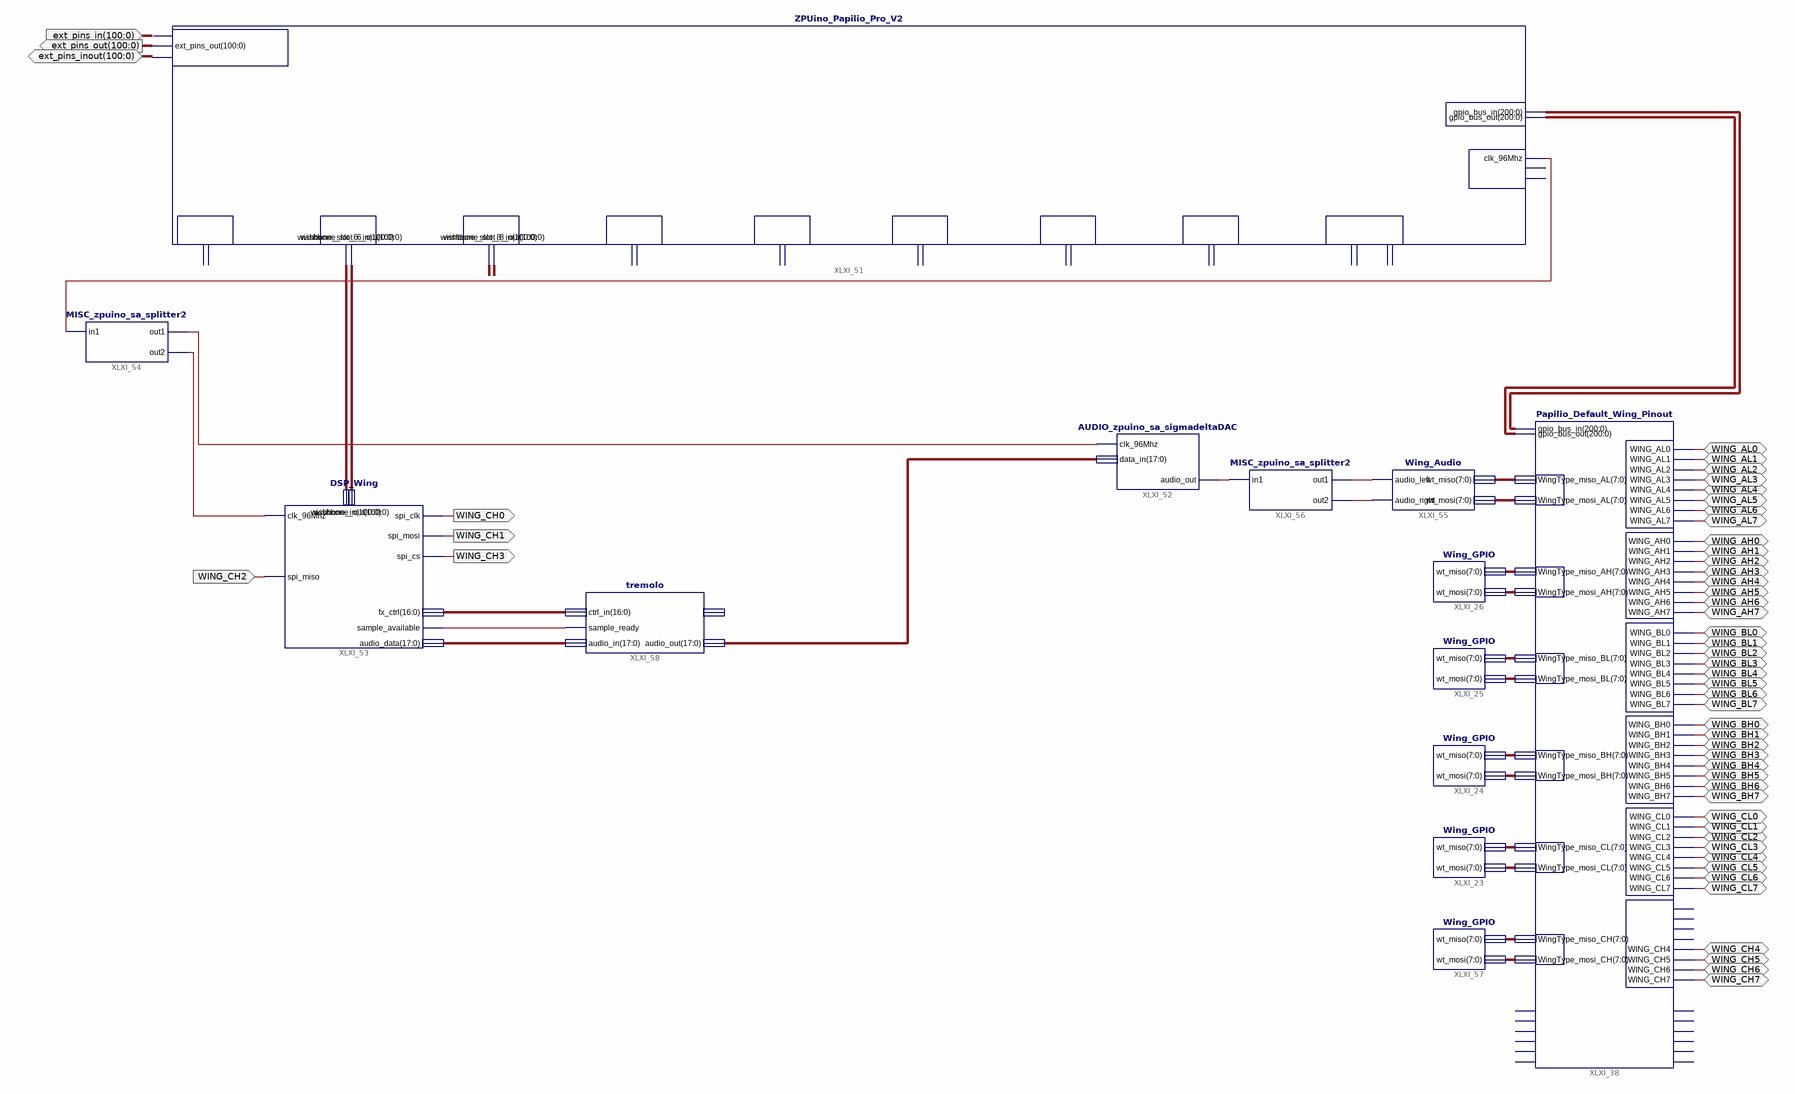
[diagram p0: schematic sheet 1]
// Xilinx ISE schematic Papilio_Pro.sch (spartan6) as structural Verilog: 13 symbols, 51 ports
module Papilio_Pro (
  input  [100:0] ext_pins_in,
  input  WING_CH2,
  inout  WING_AH0,
  inout  WING_AH1,
  inout  WING_AH2,
  inout  WING_AH3,
  inout  WING_AH4,
  inout  WING_AH5,
  inout  WING_AH6,
  inout  WING_AH7,
  inout  WING_BL0,
  inout  WING_BL1,
  inout  WING_BL2,
  inout  WING_BL3,
  inout  WING_BL4,
  inout  WING_BL5,
  inout  WING_BL6,
  inout  WING_BL7,
  inout  WING_BH0,
  inout  WING_BH1,
  inout  WING_BH2,
  inout  WING_BH3,
  inout  WING_BH4,
  inout  WING_BH5,
  inout  WING_BH6,
  inout  WING_BH7,
  inout  WING_CL4,
  inout  WING_CL5,
  inout  WING_CL6,
  inout  WING_CL7,
  inout  WING_CH4,
  inout  WING_CH5,
  inout  WING_CH6,
  inout  WING_CH7,
  inout  [100:0] ext_pins_inout,
  inout  WING_AL0,
  inout  WING_AL1,
  inout  WING_AL2,
  inout  WING_AL3,
  inout  WING_AL5,
  inout  WING_AL7,
  inout  WING_AL4,
  inout  WING_AL6,
  inout  WING_CL0,
  inout  WING_CL2,
  inout  WING_CL3,
  inout  WING_CL1,
  output [100:0] ext_pins_out,
  output WING_CH0,
  output WING_CH1,
  output WING_CH3
);

  wire XLXN_529, XLXN_530, XLXN_531, XLXN_538, XLXN_544, XLXN_588, XLXN_590;
  wire [7:0] XLXN_327, XLXN_328, XLXN_329, XLXN_330, XLXN_331, XLXN_332, XLXN_333, XLXN_334, XLXN_335,
       XLXN_336, XLXN_582, XLXN_583;
  wire [16:0] XLXN_592;
  wire [17:0] XLXN_594, XLXN_595;
  wire [100:0] XLXN_598, XLXN_599, XLXN_602, XLXN_603;
  wire [200:0] XLXN_408, XLXN_409;

  Wing_GPIO XLXI_26 (.wt_miso(XLXN_333), .wt_mosi(XLXN_334));
  Wing_GPIO XLXI_25 (.wt_miso(XLXN_331), .wt_mosi(XLXN_332));
  Wing_GPIO XLXI_24 (.wt_miso(XLXN_329), .wt_mosi(XLXN_330));
  Wing_GPIO XLXI_23 (.wt_miso(XLXN_327), .wt_mosi(XLXN_328));
  Papilio_Default_Wing_Pinout XLXI_38 (
    .WING_AH0(WING_AH0), .WING_AH1(WING_AH1), .WING_AH2(WING_AH2), .WING_AH3(WING_AH3), .WING_AH4(WING_AH4),
    .WING_AH5(WING_AH5), .WING_AH6(WING_AH6), .WING_AH7(WING_AH7), .WING_AL0(WING_AL0), .WING_AL1(WING_AL1),
    .WING_AL2(WING_AL2), .WING_AL3(WING_AL3), .WING_AL4(WING_AL4), .WING_AL5(WING_AL5), .WING_AL6(WING_AL6),
    .WING_AL7(WING_AL7), .WING_BH0(WING_BH0), .WING_BH1(WING_BH1), .WING_BH2(WING_BH2), .WING_BH3(WING_BH3),
    .WING_BH4(WING_BH4), .WING_BH5(WING_BH5), .WING_BH6(WING_BH6), .WING_BH7(WING_BH7), .WING_BL0(WING_BL0),
    .WING_BL1(WING_BL1), .WING_BL2(WING_BL2), .WING_BL3(WING_BL3), .WING_BL4(WING_BL4), .WING_BL5(WING_BL5),
    .WING_BL6(WING_BL6), .WING_BL7(WING_BL7), .WING_CL0(WING_CL0), .WING_CL1(WING_CL1), .WING_CL2(WING_CL2),
    .WING_CL3(WING_CL3), .WING_CL4(WING_CL4), .WING_CL5(WING_CL5), .WING_CL6(WING_CL6), .WING_CL7(WING_CL7),
    .WING_CH4(WING_CH4), .WING_CH5(WING_CH5), .WING_CH6(WING_CH6), .WING_CH7(WING_CH7),
    .gpio_bus_out(XLXN_408), .gpio_bus_in(XLXN_409), .WingType_miso_BH(XLXN_329),
    .WingType_miso_BL(XLXN_331), .WingType_miso_AH(XLXN_333), .WingType_mosi_BL(XLXN_332),
    .WingType_mosi_BH(XLXN_330), .WingType_mosi_CL(XLXN_328), .WingType_mosi_AH(XLXN_334),
    .WingType_miso_CL(XLXN_327), .WingType_miso_CH(XLXN_582), .WingType_mosi_CH(XLXN_583),
    .WingType_mosi_AL(XLXN_336), .WingType_miso_AL(XLXN_335));  // open: WING_CH0, WING_CH1, WING_CH2, WING_CH3, Flex_Pin_out_0, Flex_Pin_out_1, Flex_Pin_out_2, Flex_Pin_out_3, Flex_Pin_out_4, Flex_Pin_out_5, Flex_Pin_in_0, Flex_Pin_in_1, Flex_Pin_in_2, Flex_Pin_in_3, Flex_Pin_in_4, Flex_Pin_in_5
  ZPUino_Papilio_Pro_V2 XLXI_51 (
    .gpio_bus_out(XLXN_408), .gpio_bus_in(XLXN_409), .clk_96Mhz(XLXN_538), .ext_pins_in(ext_pins_in),
    .ext_pins_out(ext_pins_out), .ext_pins_inout(ext_pins_inout), .wishbone_slot_6_in(XLXN_603),
    .wishbone_slot_6_out(XLXN_602), .wishbone_slot_8_in(XLXN_598), .wishbone_slot_8_out(XLXN_599));  // open: clk_1Mhz, clk_osc_32Mhz, wishbone_slot_5_out, wishbone_slot_5_in, wishbone_slot_9_in, wishbone_slot_9_out, wishbone_slot_10_in, wishbone_slot_10_out, wishbone_slot_11_in, wishbone_slot_11_out, wishbone_slot_12_in, wishbone_slot_12_out, wishbone_slot_13_in, wishbone_slot_13_out, wishbone_slot_14_in, wishbone_slot_14_out, wishbone_slot_video_in, wishbone_slot_video_out
  AUDIO_zpuino_sa_sigmadeltaDAC XLXI_52 (.data_in(XLXN_595), .audio_out(XLXN_531), .clk_96Mhz(XLXN_544));
  DSP_Wing XLXI_53 (
    .clk_96Mhz(XLXN_588), .spi_miso(WING_CH2), .spi_clk(WING_CH0), .spi_mosi(WING_CH1), .spi_cs(WING_CH3),
    .audio_data(XLXN_594), .sample_available(XLXN_590), .fx_ctrl(XLXN_592), .wishbone_out(XLXN_602),
    .wishbone_in(XLXN_603));
  MISC_zpuino_sa_splitter2 XLXI_54 (.in1(XLXN_538), .out1(XLXN_544), .out2(XLXN_588));
  Wing_Audio XLXI_55 (.audio_left(XLXN_529), .audio_right(XLXN_530), .wt_miso(XLXN_335), .wt_mosi(XLXN_336));
  MISC_zpuino_sa_splitter2 XLXI_56 (.in1(XLXN_531), .out1(XLXN_529), .out2(XLXN_530));
  Wing_GPIO XLXI_57 (.wt_miso(XLXN_582), .wt_mosi(XLXN_583));
  tremolo XLXI_58 (
    .sample_ready(XLXN_590), .audio_in(XLXN_594), .ctrl_in(XLXN_592), .audio_out(XLXN_595));  // open: ctrl_out
endmodule
